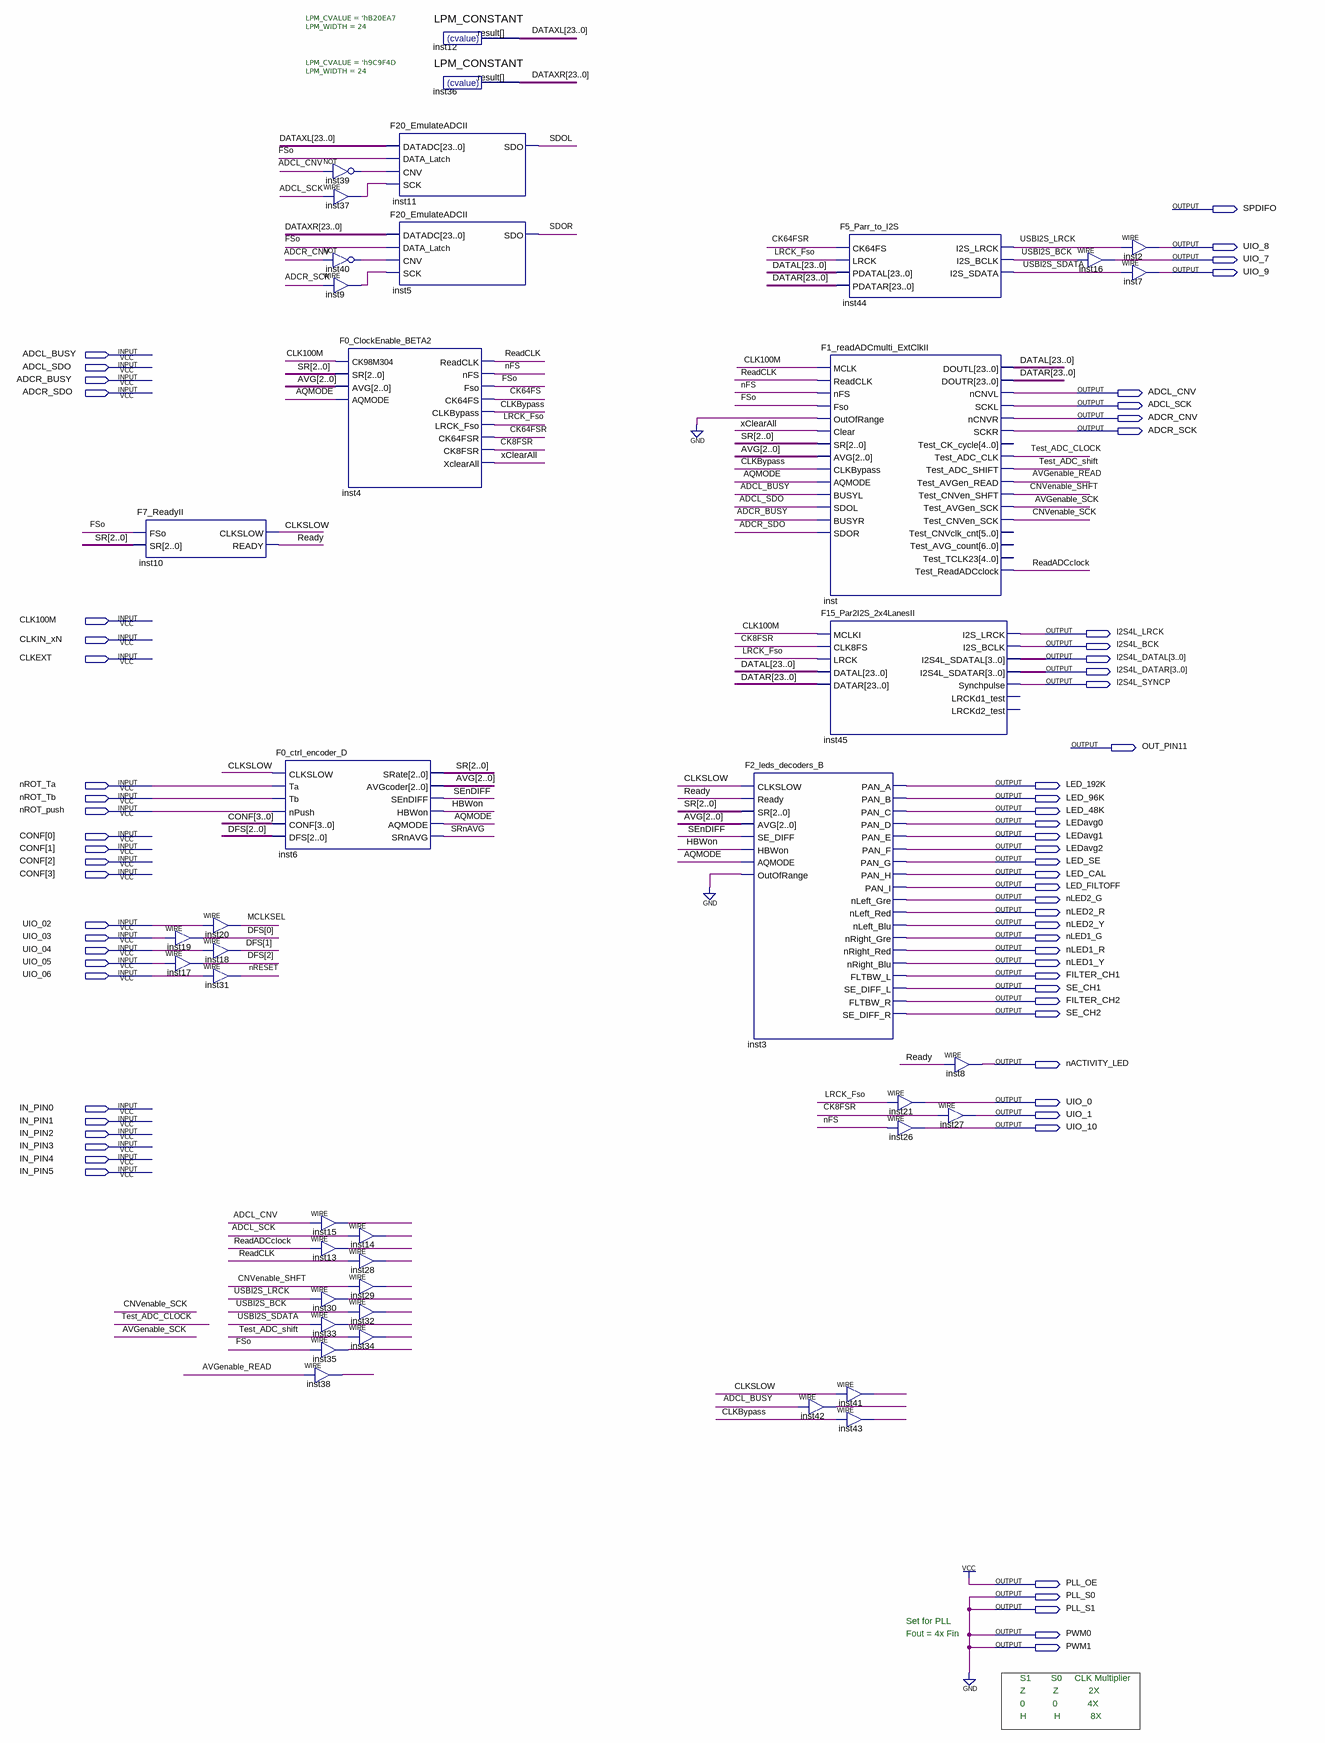
[diagram p0: schematic sheet]
// Quartus schematic AA2380_MAXV.bdf as structural Verilog: 41 symbols, 67 pins
module AA2380_MAXV (
  input  ADCL_BUSY,
  input  ADCL_SDO,
  input  ADCR_BUSY,
  input  ADCR_SDO,
  input  CLK100M,
  input  CLKIN_xN,
  input  CLKEXT,
  input  nROT_Ta,
  input  nROT_Tb,
  input  nROT_push,
  input  [3:0] CONF,
  input  UIO_02,
  input  UIO_03,
  input  UIO_04,
  input  UIO_05,
  input  UIO_06,
  input  IN_PIN0,
  input  IN_PIN1,
  input  IN_PIN2,
  input  IN_PIN3,
  input  IN_PIN4,
  input  IN_PIN5,
  output SPDIFO,
  output UIO_8,
  output UIO_7,
  output UIO_9,
  output ADCL_CNV,
  output ADCL_SCK,
  output ADCR_CNV,
  output ADCR_SCK,
  output I2S4L_LRCK,
  output I2S4L_BCK,
  output [3:0] I2S4L_DATAL,
  output [3:0] I2S4L_DATAR,
  output I2S4L_SYNCP,
  output OUT_PIN11,
  output LED_192K,
  output LED_96K,
  output LED_48K,
  output LEDavg0,
  output LEDavg1,
  output LEDavg2,
  output LED_SE,
  output LED_CAL,
  output LED_FILTOFF,
  output nLED2_G,
  output nLED2_R,
  output nLED2_Y,
  output nLED1_G,
  output nLED1_R,
  output nLED1_Y,
  output FILTER_CH1,
  output SE_CH1,
  output FILTER_CH2,
  output SE_CH2,
  output nACTIVITY_LED,
  output UIO_0,
  output UIO_1,
  output UIO_10,
  output PLL_OE,
  output PLL_S0,
  output PLL_S1,
  output PWM0,
  output PWM1
);

  wire AQMODE, AVGenable_READ, AVGenable_SCK, CK8FSR, CK64FS, CK64FSR, CLKBypass, CLKSLOW, CNVenable_SCK,
       CNVenable_SHFT, FSo, HBWon, inst9_out, inst13_out, inst14_out, inst15_out, inst28_out, inst29_out,
       inst30_out, inst32_out, inst33_out, inst34_out, inst35_out, inst37_out, inst38_out, inst39_out,
       inst40_out, inst41_out, inst42_out, inst43_out, LRCK_Fso, MCLKSEL, nFS, nRESET, ReadADCclock, ReadCLK,
       Ready, SDOL, SDOR, SEnDIFF, SRnAVG, Test_ADC_CLOCK, Test_ADC_shift, USBI2S_BCK, USBI2S_LRCK,
       USBI2S_SDATA, xClearAll;
  wire [2:0] AVG, DFS, SR;
  wire [23:0] DATAL, DATAR, DATAXL, DATAXR;

  F7_ReadyII inst10 (.FSo(FSo), .SR(SR), .CLKSLOW(CLKSLOW), .READY(Ready));
  assign DFS[0] = UIO_03;  // WIRE inst19
  assign DFS[2] = UIO_05;  // WIRE inst17
  assign MCLKSEL = UIO_02;  // WIRE inst20
  assign DFS[1] = UIO_04;  // WIRE inst18
  assign nRESET = UIO_06;  // WIRE inst31
  F0_ctrl_encoder_D inst6 (
    .CLKSLOW(CLKSLOW), .Ta(nROT_Ta), .Tb(nROT_Tb), .nPush(nROT_push), .CONF(CONF), .DFS(DFS), .SRate(SR),
    .AVGcoder(AVG), .SEnDIFF(SEnDIFF), .HBWon(HBWon), .AQMODE(AQMODE), .SRnAVG(SRnAVG));
  not inst39 (inst39_out, ADCL_CNV);
  assign inst37_out = ADCL_SCK;  // WIRE inst37
  not inst40 (inst40_out, ADCR_CNV);
  assign inst9_out = ADCR_SCK;  // WIRE inst9
  F0_ClockEnable_BETA2 inst4 (
    .CK98M304(CLK100M), .SR(SR), .AVG(AVG), .AQMODE(AQMODE), .ReadCLK(ReadCLK), .nFS(nFS), .Fso(FSo),
    .CK64FS(CK64FS), .CLKBypass(CLKBypass), .LRCK_Fso(LRCK_Fso), .CK64FSR(CK64FSR), .CK8FSR(CK8FSR),
    .XclearAll(xClearAll));
  assign inst15_out = ADCL_CNV;  // WIRE inst15
  assign inst13_out = ReadADCclock;  // WIRE inst13
  assign inst30_out = USBI2S_LRCK;  // WIRE inst30
  assign inst33_out = USBI2S_SDATA;  // WIRE inst33
  assign inst35_out = FSo;  // WIRE inst35
  assign inst38_out = AVGenable_READ;  // WIRE inst38
  F20_EmulateADCII inst11 (.DATADC(DATAXL), .DATA_Latch(FSo), .CNV(inst39_out), .SCK(inst37_out), .SDO(SDOL));
  F20_EmulateADCII inst5 (.DATADC(DATAXR), .DATA_Latch(FSo), .CNV(inst40_out), .SCK(inst9_out), .SDO(SDOR));
  assign inst14_out = ADCL_SCK;  // WIRE inst14
  assign inst28_out = ReadCLK;  // WIRE inst28
  assign inst29_out = CNVenable_SHFT;  // WIRE inst29
  assign inst32_out = USBI2S_BCK;  // WIRE inst32
  assign inst34_out = Test_ADC_shift;  // WIRE inst34
  LPM_CONSTANT #(.LPM_CVALUE('hB20EA7), .LPM_WIDTH(24)) inst12 (.result(DATAXL));
  LPM_CONSTANT #(.LPM_CVALUE('h9C9F4D), .LPM_WIDTH(24)) inst36 (.result(DATAXR));
  F2_leds_decoders_B inst3 (
    .CLKSLOW(CLKSLOW), .Ready(Ready), .SR(SR), .AVG(AVG), .SE_DIFF(SEnDIFF), .HBWon(HBWon), .AQMODE(AQMODE),
    .OutOfRange(1'b0), .PAN_A(LED_192K), .PAN_B(LED_96K), .PAN_C(LED_48K), .PAN_D(LEDavg0), .PAN_E(LEDavg1),
    .PAN_F(LEDavg2), .PAN_G(LED_SE), .PAN_H(LED_CAL), .PAN_I(LED_FILTOFF), .nLeft_Gre(nLED2_G),
    .nLeft_Red(nLED2_R), .nLeft_Blu(nLED2_Y), .nRight_Gre(nLED1_G), .nRight_Red(nLED1_R),
    .nRight_Blu(nLED1_Y), .FLTBW_L(FILTER_CH1), .SE_DIFF_L(SE_CH1), .FLTBW_R(FILTER_CH2), .SE_DIFF_R(SE_CH2));
  F5_Parr_to_I2S inst44 (
    .CK64FS(CK64FSR), .LRCK(LRCK_Fso), .PDATAL(DATAL), .PDATAR(DATAR), .I2S_LRCK(USBI2S_LRCK),
    .I2S_BCLK(USBI2S_BCK), .I2S_SDATA(USBI2S_SDATA));
  F1_readADCmulti_ExtClkII inst (
    .MCLK(CLK100M), .ReadCLK(ReadCLK), .nFS(nFS), .Fso(FSo), .OutOfRange(1'b0), .Clear(xClearAll), .SR(SR),
    .AVG(AVG), .CLKBypass(CLKBypass), .AQMODE(AQMODE), .BUSYL(ADCL_BUSY), .SDOL(ADCL_SDO), .BUSYR(ADCR_BUSY),
    .SDOR(ADCR_SDO), .DOUTL(DATAL), .DOUTR(DATAR), .nCNVL(ADCL_CNV), .SCKL(ADCL_SCK), .nCNVR(ADCR_CNV),
    .SCKR(ADCR_SCK), .Test_ADC_CLK(Test_ADC_CLOCK), .Test_ADC_SHIFT(Test_ADC_shift),
    .Test_AVGen_READ(AVGenable_READ), .Test_CNVen_SHFT(CNVenable_SHFT), .Test_AVGen_SCK(AVGenable_SCK),
    .Test_CNVen_SCK(CNVenable_SCK), .Test_ReadADCclock(ReadADCclock));  // open: Test_CK_cycle, Test_CNVclk_cnt, Test_AVG_count, Test_TCLK23
  F15_Par2I2S_2x4LanesII inst45 (
    .MCLKI(CLK100M), .CLK8FS(CK8FSR), .LRCK(LRCK_Fso), .DATAL(DATAL), .DATAR(DATAR), .I2S_LRCK(I2S4L_LRCK),
    .I2S_BCLK(I2S4L_BCK), .I2S4L_SDATAL(I2S4L_DATAL), .I2S4L_SDATAR(I2S4L_DATAR), .Synchpulse(I2S4L_SYNCP));  // open: LRCKd1_test, LRCKd2_test
  assign inst41_out = CLKSLOW;  // WIRE inst41
  assign inst42_out = ADCL_BUSY;  // WIRE inst42
  assign inst43_out = CLKBypass;  // WIRE inst43
  assign UIO_0 = LRCK_Fso;  // WIRE inst21
  assign UIO_10 = nFS;  // WIRE inst26
  assign nACTIVITY_LED = Ready;  // WIRE inst8
  assign UIO_1 = CK8FSR;  // WIRE inst27
  assign UIO_7 = USBI2S_BCK;  // WIRE inst16
  assign UIO_8 = USBI2S_LRCK;  // WIRE inst2
  assign UIO_9 = USBI2S_SDATA;  // WIRE inst7

  assign PLL_OE = 1'b1;
  assign PLL_S0 = 1'b0;
  assign PLL_S1 = 1'b0;
  assign PWM0 = 1'b0;
  assign PWM1 = 1'b0;

  // Notes on the sheet:
  //   Set for PLL
  //   Fout = 4x Fin
  //   S1        S0     CLK Multiplier
  //   Z           Z            2X
  //   0           0            4X
  //   H           H            8X
endmodule
